# EAGLE design HighVBoard_02 (EAGLE 9.2.2)
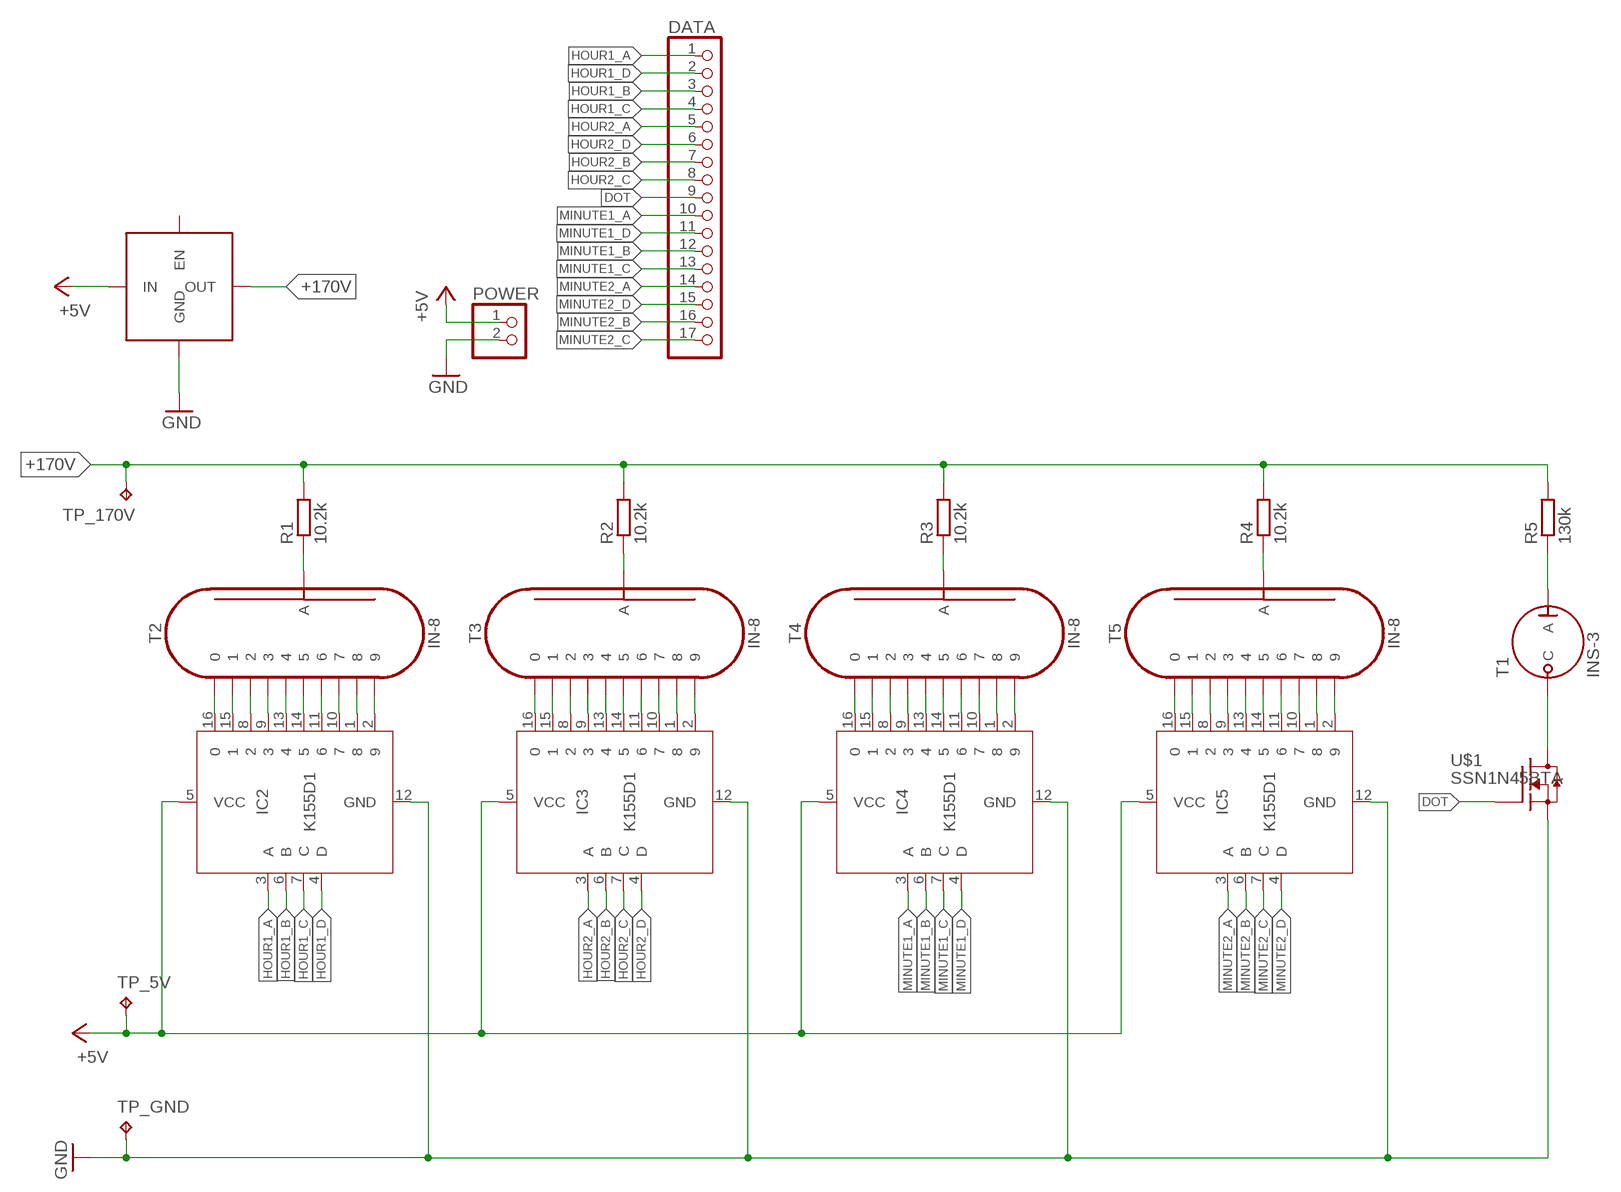
[diagram p0: schematic, sheet 1]

## Parts
DATA  PINHD-1X17  [1X17]
IC2  K155D1  [DIL16]
IC3  K155D1  [DIL16]
IC4  K155D1  [DIL16]
IC5  K155D1  [DIL16]
POWER  PINHD-1X2  [1X02]
R1  10.2k  R-EU_0207/10  [0207/10]
R2  10.2k  R-EU_0207/10  [0207/10]
R3  10.2k  R-EU_0207/10  [0207/10]
R4  10.2k  R-EU_0207/10  [0207/10]
R5  130k  R-EU_0207/10  [0207/10]
T1  INS-3  [INS-3]
T2  IN-8  [IN-8]
T3  IN-8  [IN-8]
T4  IN-8  [IN-8]
T5  IN-8  [IN-8]
TP_5V  TPPAD1-13  [P1-13]
TP_170V  TPPAD1-13  [P1-13]
TP_GND  TPPAD1-13  [P1-13]
U$1  SSN1N45BTA  [TO92]
U$2  NIXIE-PSU  [NIXIE-PSU]

## Nets
+5V [+5V]: IC2.5(VCC) IC3.5(VCC) IC4.5(VCC) IC5.5(VCC) POWER.1 TP_5V.TP U$2.1(IN)
+170V [+170V]: R1.2 R2.2 R3.2 R4.2 R5.2 TP_170V.TP U$2.5(OUT)
DOT: DATA.9 U$1.1(G)
GND [GND]: IC2.12(GND) IC3.12(GND) IC4.12(GND) IC5.12(GND) POWER.2 TP_GND.TP U$1.3(S) U$2.2(GND) U$2.4(GND)
HOUR1_A: DATA.1 IC2.3(A)
HOUR1_B: DATA.3 IC2.6(B)
HOUR1_C: DATA.4 IC2.7(C)
HOUR1_D: DATA.2 IC2.4(D)
HOUR2_A: DATA.5 IC3.3(A)
HOUR2_B: DATA.7 IC3.6(B)
HOUR2_C: DATA.8 IC3.7(C)
HOUR2_D: DATA.6 IC3.4(D)
MINUTE1_A: DATA.10 IC4.3(A)
MINUTE1_B: DATA.12 IC4.6(B)
MINUTE1_C: DATA.13 IC4.7(C)
MINUTE1_D: DATA.11 IC4.4(D)
MINUTE2_A: DATA.14 IC5.3(A)
MINUTE2_B: DATA.16 IC5.6(B)
MINUTE2_C: DATA.17 IC5.7(C)
MINUTE2_D: DATA.15 IC5.4(D)
N$1: T1.C U$1.2(D)
N$7 [+170V]: IC2.16 T2.10
N$10 [+170V]: IC2.15 T2.1
N$11 [+170V]: IC2.8 T2.2
N$12 [+170V]: IC2.9 T2.3
N$13 [+170V]: IC2.13 T2.4
N$14 [+170V]: IC2.14 T2.5
N$15 [+170V]: IC2.11 T2.6
N$16 [+170V]: IC2.10 T2.7
N$17 [+170V]: IC2.1 T2.8
N$18 [+170V]: IC2.2 T2.9
N$19 [+170V]: R1.1 T2.A
N$20 [+170V]: IC3.16 T3.10
N$21 [+170V]: IC3.15 T3.1
N$22 [+170V]: IC3.8 T3.2
N$23 [+170V]: IC3.9 T3.3
N$24 [+170V]: IC3.13 T3.4
N$25 [+170V]: IC3.14 T3.5
N$26 [+170V]: IC3.11 T3.6
N$27 [+170V]: IC3.10 T3.7
N$28 [+170V]: IC3.1 T3.8
N$29 [+170V]: IC3.2 T3.9
N$30 [+170V]: R2.1 T3.A
N$31 [+170V]: IC4.16 T4.10
N$32 [+170V]: IC4.15 T4.1
N$33 [+170V]: IC4.8 T4.2
N$34 [+170V]: IC4.9 T4.3
N$35 [+170V]: IC4.13 T4.4
N$36 [+170V]: IC4.14 T4.5
N$37 [+170V]: IC4.11 T4.6
N$38 [+170V]: IC4.10 T4.7
N$39 [+170V]: IC4.1 T4.8
N$40 [+170V]: IC4.2 T4.9
N$41 [+170V]: R3.1 T4.A
N$42 [+170V]: IC5.16 T5.10
N$43 [+170V]: IC5.15 T5.1
N$44 [+170V]: IC5.8 T5.2
N$45 [+170V]: IC5.9 T5.3
N$46 [+170V]: IC5.13 T5.4
N$47 [+170V]: IC5.14 T5.5
N$48 [+170V]: IC5.11 T5.6
N$49 [+170V]: IC5.10 T5.7
N$50 [+170V]: IC5.1 T5.8
N$51 [+170V]: IC5.2 T5.9
N$52 [+170V]: R4.1 T5.A
N$55 [+170V]: R5.1 T1.A
Unconnected: U$2.3(EN)

## Library data of the parts
DATA = pinhead:PINHD-1X17: PIN HEADER
IC2-IC5 = Nixie:K155D1
POWER = pinhead:PINHD-1X2: PIN HEADER
R1-R5 = resistor:R-EU_: RESISTOR, European symbol
T1 = Nixie:INS-3
T2-T5 = Nixie:IN-8
TP_5V TP_170V TP_GND = testpad:TP: Test pad
U$1 = Nixie:SSN1N45BTA
U$2 = Nixie:NIXIE-PSU

## Net classes
0 SIGNAL: width 0.203 mm, clearance 0.203 mm
2 +5V: width 0.406 mm, clearance 0.203 mm
3 +170V: width 0.203 mm, clearance 0.406 mm
4 GND: clearance 0.203 mm

## Board
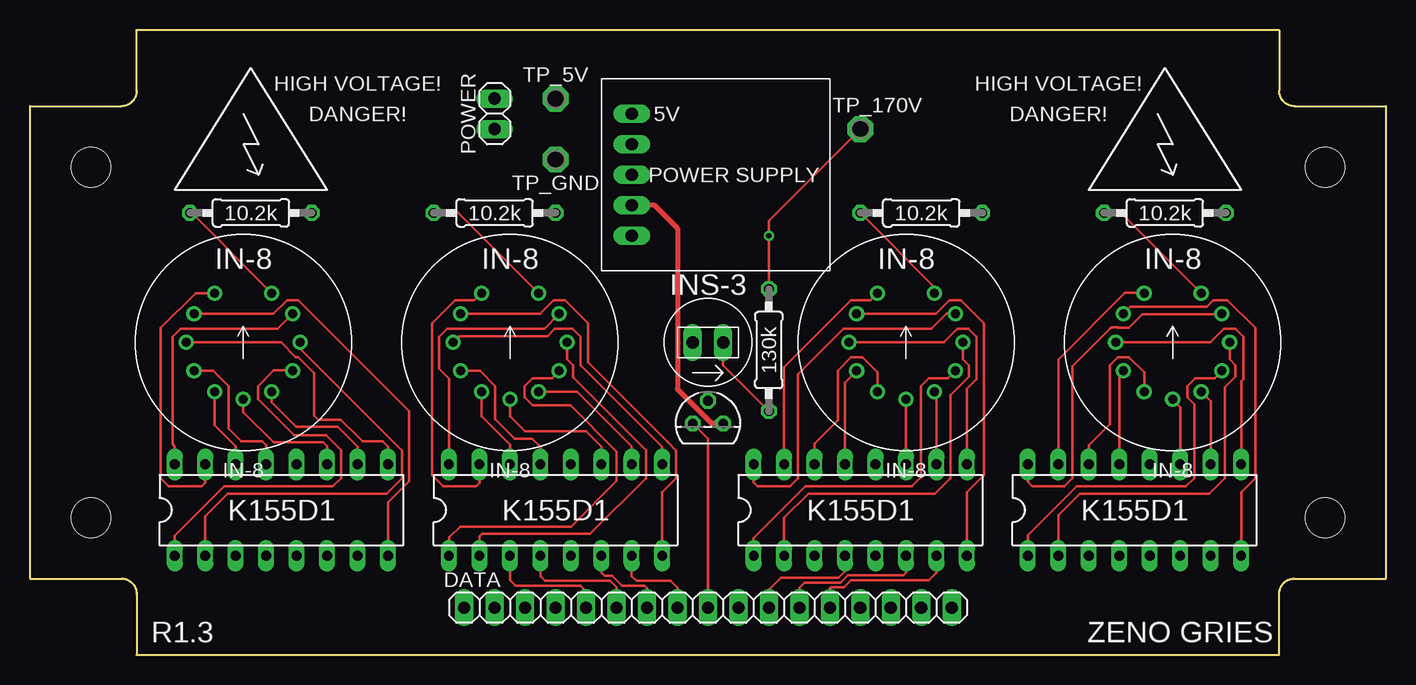
[diagram p1: board, top side]
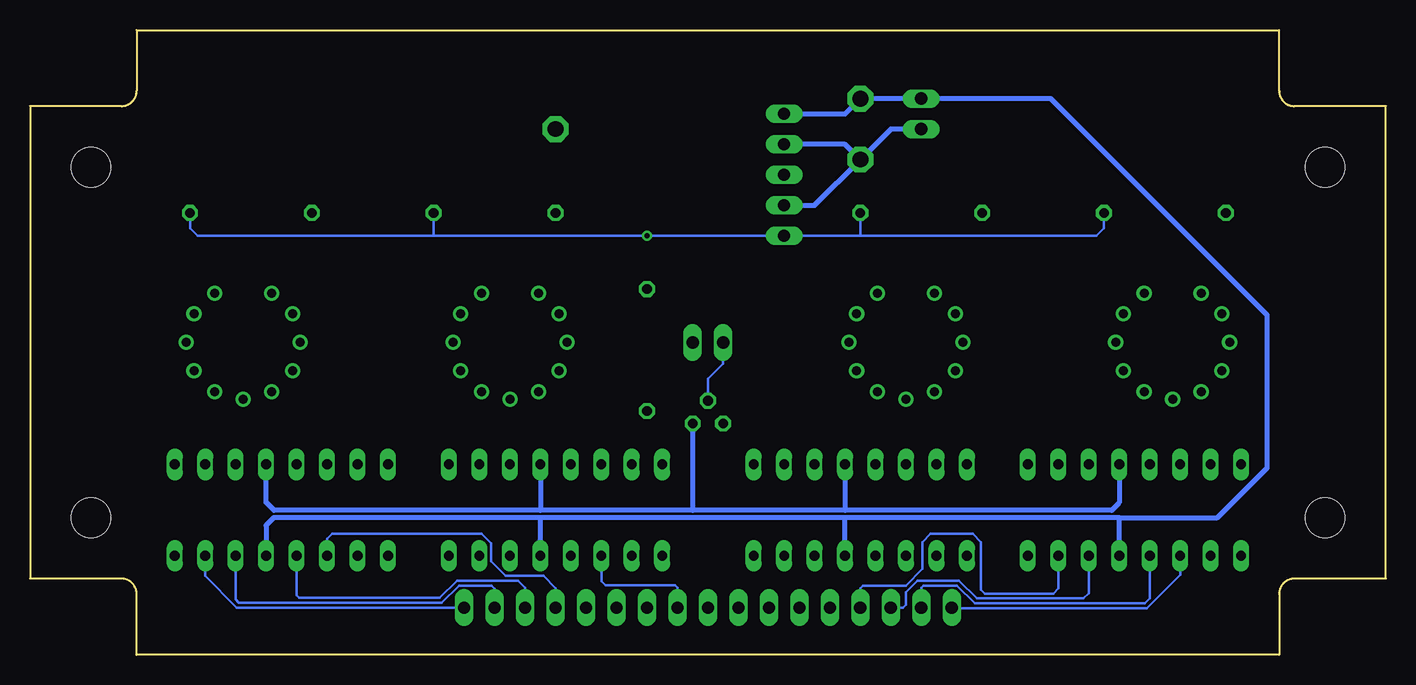
[diagram p2: board, bottom side, seen from below]

Size 113.03 x 52.07 mm. Coordinates in mm from the lower left corner, seen from the top.
Outline: 0,6.35 0,45.72 7.62,45.72 arc90 8.89,46.99 8.89,52.07 104.14,52.07 104.14,46.99 arc90 105.41,45.72 113.03,45.72 113.03,6.35 105.41,6.35 arc90 104.14,5.08 104.14,0 8.89,0 8.89,5.08 arc90 7.62,6.35 0,6.35
Copper layers (1*16): Top 0.035mm / dielectric 1.5mm / Bottom 0.035mm
Design rules "default": minimum track width 6mil, minimum drill 0.35mm, track to track 6mil, track to pad 6mil, pad to pad 6mil, via to via 6mil, smd to smd 6mil, copper to edge 40mil, drill to drill 6mil, minimum pad ring 10mil, minimum via ring 8mil, stop-mask expansion 4mil, vias tented up to drill 0mil, thermal gap 10mil
Holes 3.3 mm at 5.08,40.64 5.08,11.43 107.95,40.64 107.95,11.43

### Footprints (pad centres in the part's own frame; a part is rotated, then mirrored left to right if it is on the bottom)
1X17 = drill 1.016 long: 1 -20.32,0; 2 -17.78,0; 3 -15.24,0; 4 -12.7,0; 5 -10.16,0; 6 -7.62,0; 7 -5.08,0; 8 -2.54,0; 9 0,0; 10 2.54,0; 11 5.08,0; 12 7.62,0; 13 10.16,0; 14 12.7,0; 15 15.24,0; 16 17.78,0; 17 20.32,0
DIL16 = drill 0.813 long: 1 -8.89,-3.81; 2 -6.35,-3.81; 3 -3.81,-3.81; 4 -1.27,-3.81; 5 1.27,-3.81; 6 3.81,-3.81; 7 6.35,-3.81; 8 8.89,-3.81; 9 8.89,3.81; 10 6.35,3.81; 11 3.81,3.81; 12 1.27,3.81; 13 -1.27,3.81; 14 -3.81,3.81; 15 -6.35,3.81; 16 -8.89,3.81
1X02 = drill 1.016 long: 1 -1.27,0; 2 1.27,0
0207/10 = drill 0.813 octagon: 1 -5.08,0; 2 5.08,0
INS-3 = drill 1.016 long: A 1.27,0; C -1.27,0
IN-8 = drill 0.75: 1 -2.375,4.11; 2 -4.11,2.375; 3 -4.75,0; 4 -4.11,-2.375; 5 -2.375,-4.11; 6 0,-4.75; 7 2.375,-4.11; 8 4.11,-2.375; 9 4.75,0; 10 4.11,2.375; A 2.375,4.11
P1-13 = drill 1.321 pad 2.159 octagon: TP 0,0
TO92 = drill 0.813 octagon: 1 -1.27,0; 2 0,1.905; 3 1.27,0
NIXIE-PSU = drill 1.016 long: 1 -5.08,0; 2 -2.54,0; 3 0,0; 4 2.54,0; 5 5.08,0

### Placement (x,y rotation side)
DATA  56.52,3.94 0 top
IC2  20.95,12.06 0 top
IC3  43.81,12.06 0 top
IC4  69.22,12.06 0 top
IC5  92.08,12.06 0 top
POWER  38.73,45.09 270 top
R1  18.41,36.83 0 top
R2  38.73,36.83 0 top
R3  74.3,36.83 0 top
R4  94.61,36.83 0 top
R5  61.59,25.4 90 top
T1  56.52,26.04 0 top
T2  17.78,26.04 0 top
T3  40.01,26.04 0 top
T4  73.03,26.04 0 top
T5  95.25,26.04 0 top
TP_5V  43.81,46.35 0 top
TP_170V  69.22,43.81 0 top
TP_GND  43.81,41.27 0 top
U$1  56.52,19.28 0 top
U$2  50.16,40.01 270 top

### Tracks (layer width: path | path; a pad name or v marks a point on that pad's centre or on a via)
+5V
  Bottom 0.406: IC2.5 22.23,11.43 | 22.23,11.43 45.09,11.43 | 45.09,11.43 70.48,11.43 | IC4.5 70.48,11.43 | IC3.5 45.09,11.43 | 22.23,11.43 14.04,11.43 9.89,15.58 9.89,28.3 27.94,46.35 POWER.1 TP_5V.TP 45.09,45.09 U$2.1 | 70.48,11.43 92.71,11.43 93.34,10.79 IC5.5
+170V  (via drill 0.45)
  Top 0.203: R5.2 v61.59,34.92 61.59,36.2 TP_170V.TP
  Bottom 0.203: 79.38,34.92 v61.59,34.92 U$2.5 43.81,34.92 | 79.38,34.92 99.06,34.92 99.69,35.56 R4.2 | R3.2 79.38,34.92 | R1.2 23.5,35.56 24.13,34.92 43.81,34.92 | R2.2 43.81,34.92
DOT
  Top 0.203: U$1.1 56.52,18.01 DATA.9
GND
  Top 0.406: U$2.4 52.07,37.47 53.98,35.56 53.98,22.13 56.83,19.28 U$1.3
  Bottom 0.406: TP_GND.TP 41.27,43.81 POWER.2 | IC2.12 22.23,12.68 22.86,12.04 45.09,12.04 | 45.09,12.04 57.78,12.04 | 57.78,12.04 70.48,12.04 | 70.48,12.04 92.69,12.04 93.34,12.7 IC5.12 | IC3.12 45.09,12.04 | IC4.12 70.48,12.04 | TP_GND.TP 45.09,42.55 U$2.2 | U$2.4 47.62,37.47 TP_GND.TP | U$1.3 57.78,12.04
HOUR1_A
  Bottom 0.203: DATA.1 36.14,3.89 19.94,3.89 17.14,6.68 IC2.3
HOUR1_B
  Bottom 0.203: IC2.6 24.77,5.13 25.2,4.7 34.11,4.7 35.59,6.17 39.04,6.17 40.01,5.21 40.01,4.19 40.26,3.94 DATA.3
HOUR1_C
  Bottom 0.203: IC2.7 27.3,5.54 27.74,5.11 33.44,5.11 33.76,5.43 33.76,9.4 34.44,10.08 37.95,10.08 38.63,9.4 38.63,7.15 40.02,5.77 43.61,5.77 43.81,5.56 DATA.4
HOUR1_D
  Bottom 0.203: IC2.4 19.69,8.25 19.69,4.71 20.11,4.29 34.28,4.29 35.75,5.77 38.56,5.77 38.73,5.59 DATA.2
HOUR2_A
  Top 0.203: DATA.5 46.35,5.31 45.9,5.77 40.46,5.77 40.01,6.22 IC3.3
HOUR2_B
  Top 0.203: DATA.7 51.44,5.56 51.23,5.77 49.34,5.77 48.53,6.58 47.9,6.58 47.62,6.86 IC3.6
HOUR2_C
  Top 0.203: DATA.8 53.98,5.59 53.39,6.17 50.55,6.17 50.16,6.55 IC3.7
HOUR2_D
  Top 0.203: DATA.6 48.9,5.64 48.36,6.17 42.93,6.17 42.55,6.55 IC3.4
MINUTE1_A
  Bottom 0.203: DATA.10 59.05,5.59 59.26,5.79 65.05,5.79 65.41,6.15 IC4.3
MINUTE1_B
  Top 0.203: DATA.12 64.14,5.59 64.57,6.02 67.58,6.02 68.19,6.63 72.8,6.63 73.03,6.86 IC4.6
MINUTE1_C
  Top 0.203: IC4.7 75.56,6.86 74.93,6.22 68.45,6.22 67.84,5.61 66.75,5.61 66.67,5.54 DATA.13
MINUTE1_D
  Top 0.203: DATA.11 61.59,5.44 62.59,6.43 67.41,6.43 67.94,6.96 IC4.4
MINUTE2_A
  Bottom 0.203: DATA.14 69.22,5.56 70.23,6.58 73.37,6.58 74.6,7.8 74.6,9.31 75.37,10.08 87.86,10.08 88.27,9.68 IC5.3
MINUTE2_B
  Bottom 0.203: DATA.16 74.3,5.52 74.54,5.77 77.28,5.77 78.7,4.34 95.61,4.34 95.89,4.62 IC5.6
MINUTE2_C
  Bottom 0.203: DATA.17 95.78,3.94 98.42,6.58 IC5.7
MINUTE2_D
  Bottom 0.203: DATA.15 71.75,5.57 72.36,6.17 77.44,6.17 78.87,4.75 90.6,4.75 90.81,4.95 IC5.4
N$1
  Bottom 0.203: T1.C 55.24,24.26 56.52,22.99 U$1.2
N$7
  Top 0.203: T2.10 20.65,27.17 12.56,27.17 11.89,26.51 11.89,17.53 12.06,17.36 IC2.16
N$10
  Top 0.203: IC2.15 14.61,14.35 14.3,14.05 11.58,14.05 10.9,14.73 10.9,27.25 13.8,30.14 T2.1
N$11
  Top 0.203: IC2.8 29.84,12.7 31.62,14.48 31.62,20.29 22.36,29.55 21.42,29.55 20.28,28.41 T2.2
N$12
  Top 0.203: T2.3 20.92,26.04 22.16,24.8 22.36,24.8 23.67,23.48 23.67,19.94 24,19.61 25.91,19.61 27.73,17.78 29.39,17.78 29.84,17.32 IC2.9
N$13
  Top 0.203: IC2.13 19.68,17.45 19.36,17.78 17.6,17.78 16.54,18.84 16.54,22.4 15.28,23.66 T2.4
N$14
  Top 0.203: IC2.14 17.14,17.37 15.39,19.13 15.39,21.91 T2.5
N$15
  Top 0.203: T2.6 17.78,20.22 20.3,17.7 24.43,17.7 24.77,17.37 IC2.11
N$16
  Top 0.203: T2.7 20.16,21.04 22.2,19 25.65,19 27.3,17.35 IC2.10
N$17
  Top 0.203: IC2.1 12.06,9.91 16.2,14.05 25.25,14.05 25.93,14.73 25.93,17.07 24.69,18.31 22.02,18.31 19.02,21.32 19.02,22.4 20.32,23.7 21.85,23.7 T2.8
N$18
  Top 0.203: IC2.2 14.61,11.56 16.48,13.44 29.72,13.44 31.01,14.73 31.01,17.02 22.53,25.5 T2.9
N$19
  Top 0.203: R1.1 13.47,36.83 T2.A
N$20
  Top 0.203: T3.10 42.88,27.17 34.78,27.17 34.12,26.51 34.12,23.83 34.92,23.02 IC3.16
N$21
  Top 0.203: IC3.15 37.47,14.32 37.19,14.05 34.44,14.05 33.51,14.98 33.51,27.63 35.42,29.55 37.03,29.55 T3.1
N$22
  Top 0.203: IC3.8 52.7,13.56 53.87,14.73 53.87,17.02 53.19,17.7 46.5,24.39 46.5,27.63 44.59,29.55 43.64,29.55 42.51,28.41 T3.2
N$23
  Top 0.203: IC3.9 52.7,17.32 45.89,24.14 45.89,26.51 45.23,27.17 43.74,27.17 43.13,26.56 35.78,26.56 T3.3
N$24
  Top 0.203: IC3.13 42.55,17.32 41.86,18.01 40.38,18.01 38.76,19.62 38.76,21.45 38.77,21.45 38.77,22.4 37.5,23.66 T3.4
N$25
  Top 0.203: IC3.14 40.01,17.52 37.63,19.89 T3.5
N$26
  Top 0.203: IC3.11 47.62,17.35 46.35,18.62 41.27,18.62 40.01,19.89 T3.6
N$27
  Top 0.203: IC3.10 50.16,17.37 45.61,21.93 T3.7
N$28
  Top 0.203: IC3.1 34.92,9.78 35.84,10.69 45.09,10.69 48.9,14.5 48.9,16.94 45.05,20.79 41.91,20.79 41.24,21.45 41.24,22.4 41.91,23.06 43.52,23.06 T3.8
N$29
  Top 0.203: IC3.2 37.47,9.88 37.67,10.08 46.69,10.08 51.33,14.73 51.33,17.07 45.25,23.15 45.25,24.13 44.76,24.63 T3.9
N$30
  Top 0.203: R2.1 35.7,36.83 T3.A
N$31
  Top 0.203: T4.10 76.39,28.41 75.15,27.17 67.8,27.17 64.03,23.4 64.03,14.73 63.35,14.05 60.65,14.05 60.33,14.38 IC4.16
N$32
  Top 0.203: T4.1 70.05,29.55 68.44,29.55 62.87,23.97 IC4.15
N$33
  Top 0.203: IC4.8 78.11,13.56 79.52,14.98 79.52,27.63 77.61,29.55 76.66,29.55 75.53,28.41 T4.2
N$34
  Top 0.203: T4.3 76.17,26.04 77.3,27.17 78.25,27.17 78.91,26.51 78.91,22.97 78.11,22.16 IC4.9
N$35
  Top 0.203: IC4.13 67.94,22.69 T4.4
N$36
  Top 0.203: IC4.14 65.41,17.6 67.33,19.53 67.33,23.69 68.44,24.8 69.39,24.8 70.65,23.53 T4.5
N$37
  Top 0.203: IC4.11 T4.6
N$38
  Top 0.203: IC4.10 75.56,21.76 T4.7
N$39
  Top 0.203: IC4.1 60.33,9.73 64.64,14.05 73.51,14.05 74.26,14.8 74.26,22.4 74.93,23.06 76.54,23.06 T4.8
N$40
  Top 0.203: IC4.2 62.87,11.4 64.9,13.44 75.44,13.44 76.73,14.73 76.73,21.65 78.27,23.19 78.27,24.13 77.78,24.63 T4.9
N$41
  Top 0.203: R3.1 75.4,30.64 T4.A
N$42
  Top 0.203: IC5.16 83.19,14.43 83.56,14.05 86.21,14.05 86.89,14.73 86.89,24.04 90.03,27.17 90.04,27.17 90.17,27.3 90.64,27.3 90.67,27.27 91.61,27.27 92.74,28.4 99.35,28.4 T5.10
N$43
  Top 0.203: T5.1 92.86,30.16 91.28,30.16 85.72,24.6 IC5.15
N$44
  Top 0.203: IC5.8 100.97,13.56 102.13,14.73 102.13,27.25 99.83,29.55 98.64,29.55 98.1,29.01 91.74,29.01 T5.2
N$45
  Top 0.203: IC5.9 100.97,22.8 101.14,22.97 101.14,26.51 100.47,27.17 99.53,27.17 98.39,26.04 T5.3
N$46
  Top 0.203: IC5.13 90.81,23.32 T5.4
N$47
  Top 0.203: IC5.14 88.27,17.48 90,19.21 90,24.13 90.67,24.8 91.61,24.8 92.88,23.53 T5.5
N$48
  Top 0.203: IC5.11 95.89,20.65 T5.6
N$49
  Top 0.203: IC5.10 98.42,21.12 T5.7
N$50
  Top 0.203: IC5.1 83.19,9.96 87.27,14.05 96.37,14.05 97.05,14.73 97.05,20.89 96.49,21.45 96.49,22.4 97.15,23.06 98.76,23.06 T5.8
N$51
  Top 0.203: IC5.2 85.72,11.63 87.53,13.44 98.3,13.44 99.59,14.73 99.59,22.29 100.5,23.19 100.5,24.13 100,24.63 T5.9
N$52
  Top 0.203: R4.1 90.94,36.83 T5.A
N$55
  Top 0.203: R5.1 57.78,24.13 T1.A

### Text on the board
tPlace: 5V | POWER SUPPLY
tNames: HIGH VOLTAGE! | HIGH VOLTAGE! | DANGER! | DANGER! | IN-8 | IN-8 | IN-8 | IN-8 | R1.3 | ZENO GRIES